# EAGLE design Qwiic EEPROM (EAGLE 9.5.2)
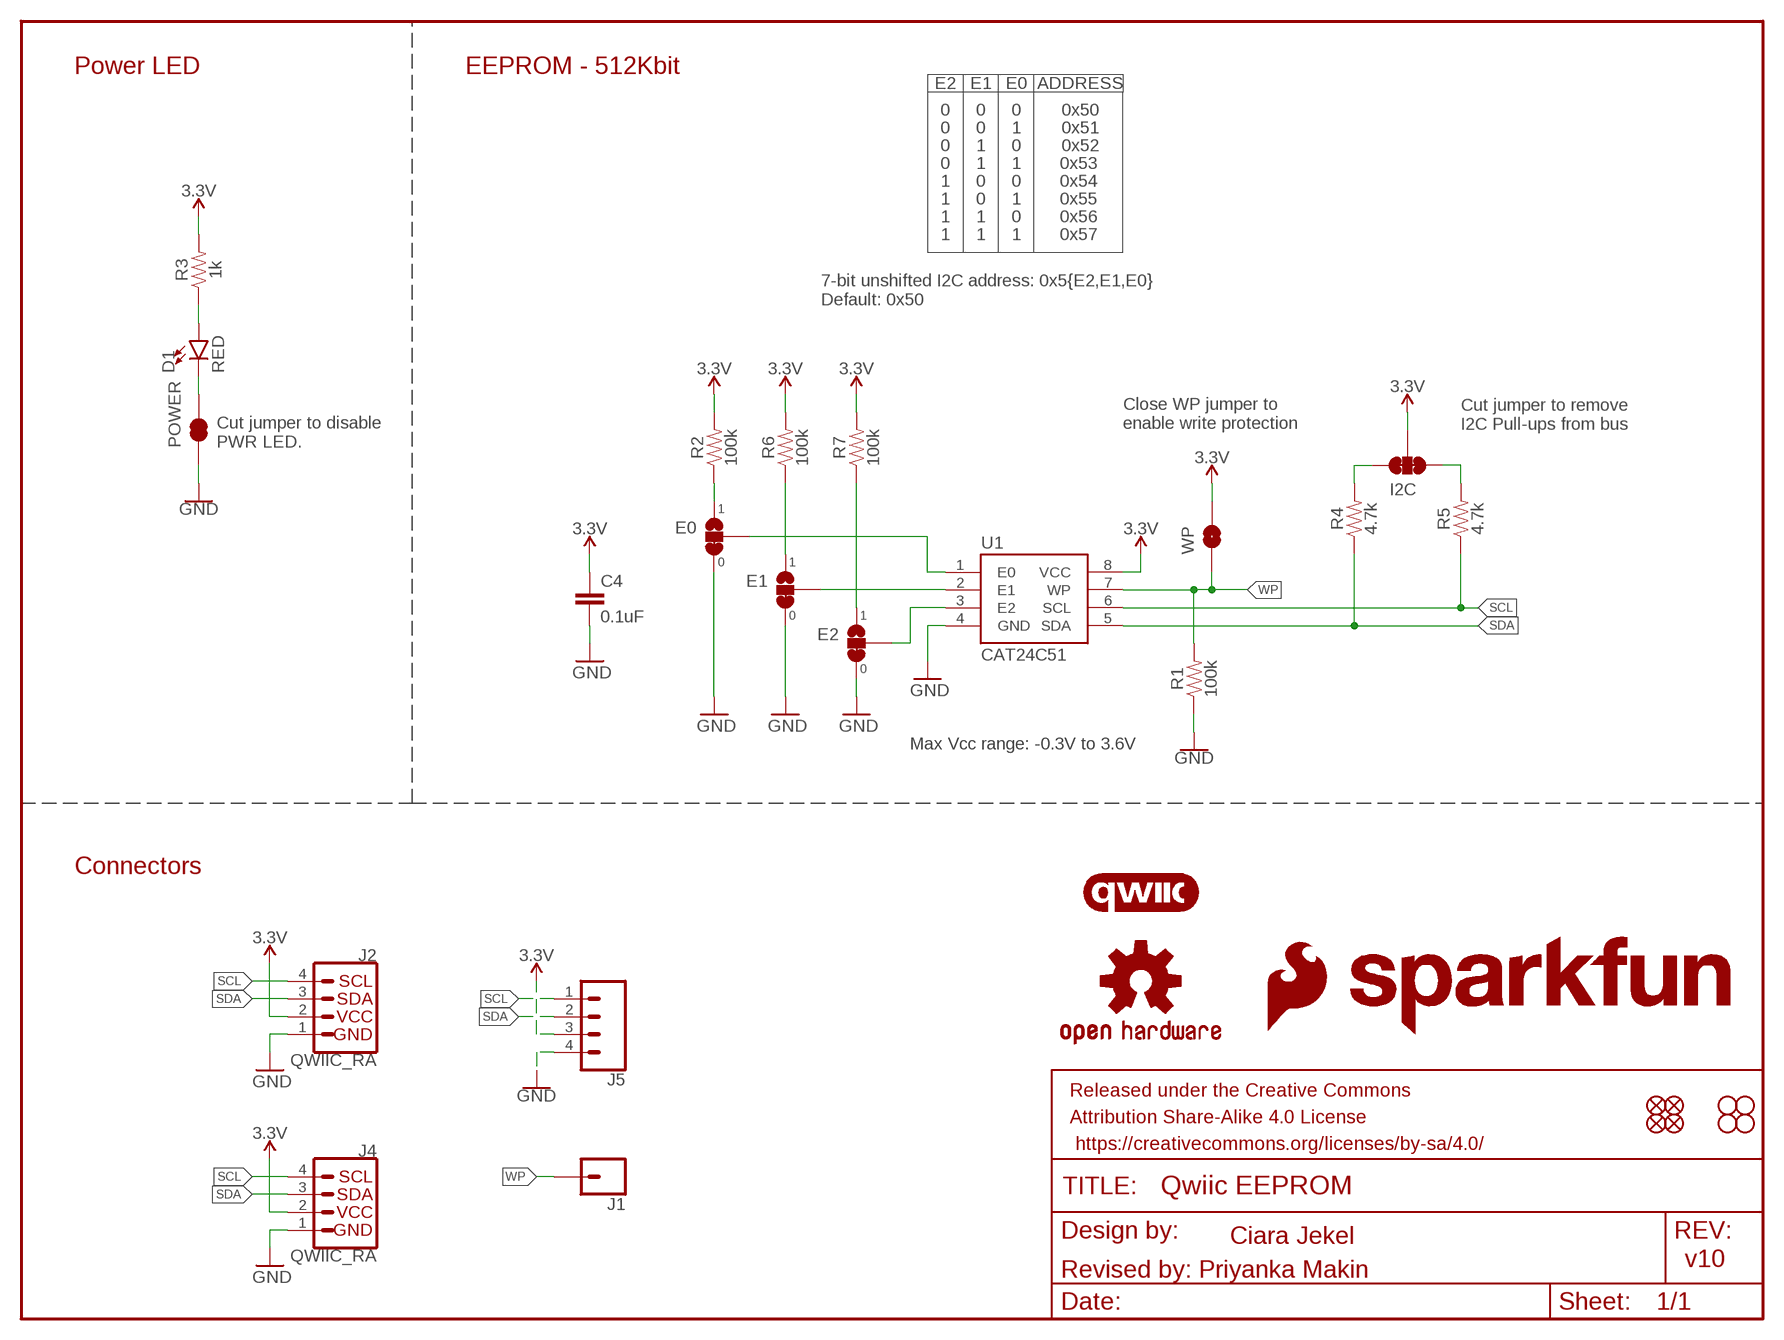
[diagram p0: schematic, sheet 1]

## Parts
C4  0.1uF  0.1UF-0603-25V-(+80/-20%)  [0603]
D1  RED  LED-RED0603  [LED-0603]
E0  JUMPER-SMT_3_1-NC_TRACE_SILK  [SMT-JUMPER_3_1-NC_TRACE_SILK]
E1  JUMPER-SMT_3_1-NC_TRACE_SILK  [SMT-JUMPER_3_1-NC_TRACE_SILK]
E2  JUMPER-SMT_3_1-NC_TRACE_SILK  [SMT-JUMPER_3_1-NC_TRACE_SILK]
FRAME1  FRAME-LETTER  [CREATIVE_COMMONS]
I2C  JUMPER-SMT_3_2-NC_TRACE_SILK  [SMT-JUMPER_3_2-NC_TRACE_SILK]
J1  CONN_01PTH_NO_SILK_YES_STOP  [1X01_NO_SILK]
J2  QWIIC_RA  QWIIC_CONNECTORJS-1MM  [JST04_1MM_RA]
J4  QWIIC_RA  QWIIC_CONNECTORJS-1MM  [JST04_1MM_RA]
J5  CONN_041X04_NO_SILK_NO_POP  [1X04_NO_SILK]
JP1  FIDUCIALUFIDUCIAL  [FIDUCIAL-MICRO]
JP2  FIDUCIALUFIDUCIAL  [FIDUCIAL-MICRO]
JP3  STAND-OFF  [STAND-OFF]
JP4  STAND-OFF  [STAND-OFF]
JP5  FIDUCIALUFIDUCIAL  [FIDUCIAL-MICRO]
JP6  FIDUCIALUFIDUCIAL  [FIDUCIAL-MICRO]
JP7  STAND-OFF  [STAND-OFF]
JP8  STAND-OFF  [STAND-OFF]
LOGO1  OSHW-LOGOMINI  [OSHW-LOGO-MINI]
LOGO2  SFE_LOGO_NAME.1_INCH  [SFE_LOGO_NAME_.1]
LOGO3  SFE_LOGO_FLAME.1_INCH  [SFE_LOGO_FLAME_.1]
LOGO4  QWIIC_LOGO_4MM  [QWIIC_4MM]
POWER  JUMPER-SMT_2_NC_TRACE_SILK  [SMT-JUMPER_2_NC_TRACE_SILK]
R1  100k  100KOHM-0603-1/10W-1%  [0603]
R2  100k  100KOHM-0603-1/10W-1%  [0603]
R3  1k  1KOHM-0603-1/10W-1%  [0603]
R4  4.7k  4.7KOHM-0603-1/10W-1%  [0603]
R5  4.7k  4.7KOHM-0603-1/10W-1%  [0603]
R6  100k  100KOHM-0603-1/10W-1%  [0603]
R7  100k  100KOHM-0603-1/10W-1%  [0603]
U1  CAT24C51  RM24C512C  [SO08]
WP  JUMPER-SMT_2_NO_SILK  [SMT-JUMPER_2_NO_SILK]

## Nets
3.3V: C4.1 I2C.2 J2.2 J4.2 J5.3 R2.2 R3.2 R6.2 R7.2 U1.8(VCC) WP.2
GND: C4.2 E0.3 E1.3 E2.3 J2.1 J4.1 J5.4 POWER.1 R1.1 U1.4(GND)
N$1: I2C.1 R5.2
N$2: I2C.3 R4.2
N$3: D1.A R3.1
N$4: E2.2 U1.3(E2)
N$5: E1.2 U1.2(E1)
N$6: E0.2 U1.1(E0)
N$7: E0.1 R2.1
N$8: E2.1 R7.1
N$9: E1.1 R6.1
N$10: D1.C POWER.2
SCL: J2.4 J4.4 J5.1 R5.1 U1.6(SCL)
SDA: J2.3 J4.3 J5.2 R4.1 U1.5(SDA)
WP: J1.1 R1.2 U1.7(WP) WP.1

## Notes on the sheet
- Power LED | EEPROM - 512Kbit
- E2 | E1 | E0 | ADDRESS
- 0 | 0 | 0 | 0x50
- 0 | 0 | 1 | 0x51
- 0 | 1 | 0 | 0x52
- 0 | 1 | 1 | 0x53
- 1 | 0 | 0 | 0x54
- 1 | 0 | 1 | 0x55
- 1 | 1 | 0 | 0x56
- 1 | 1 | 1 | 0x57
- 7-bit unshifted I2C address: 0x5{E2,E1,E0}
  Default: 0x50
- Cut jumper to remove 
  I2C Pull-ups from bus
- Cut jumper to disable 
  PWR LED.
- Close WP jumper to 
  enable write protection
- 1
- 0 | 1
- 0 | 1
- 0
- Max Vcc range: -0.3V to 3.6V
- Connectors
- Ciara Jekel
- v10
- Revised by: Priyanka Makin

## Library data of the parts
C4 = SparkFun-Capacitors:0.1UF: 0.1µF ceramic capacitors A capacitor is a passive two-terminal electrical component used to store electrical energy temporarily in an electric field.; PROD_ID: CAP-00810
D1 = SparkFun-LED:LED-RED: Red SMD LED Used in manufacturing of most products at SparkFun Packages: 0603 - SMD 0603 package [Product Link] <http://docs.avagotech.com/docs/AV02-0551EN> 0603 SMART - SMD 0603 SMART package ( more efficient and expensive)[Product Link] <http://www.osram-os.com/Graphics/XPic2/00077099_0.pdf> 1206 - SMD1206 package [Product Link] <https://www.sparkfun.com/datasheets/DevTools/LilyPad/Q150OVS4.pdff> SparkFun Products: Pro Mini 328 -5V <https://www.sparkfun.com/products/821> RedBoard <https://www.sparkfun.com/products/12757> IOIO-OTG <https://www.sparkfun.com/products/13613>; PROD_ID: DIO-00819
E0 E1 E2 = SparkFun-Jumpers:JUMPER-SMT_3_1-NC_TRACE: Normally closed trace jumper (1 of 2 connections) This jumper has a trace between two pads so it's normally closed (NC). The other connection is normally open (NO). Use a razor knife to open the connection. For best results follow the IPC guidelines for cutting traces: Cutout at least 0.063 mm (0.005 in). Remove all loose material to clean up the cut area. Seal the cut with an approved epoxy. Reapply solder to reclose the connection, or to close the NO connection.
FRAME1 = SparkFun-Aesthetics:FRAME-LETTER: Schematic Frame - Letter Standard 8.5x11 US Letter frame
I2C = SparkFun-Jumpers:JUMPER-SMT_3_2-NC_TRACE: Normally closed trace jumper (2 of 2 connections) This jumper has a trace between all three pads so they are normally closed (NC). Use a razor knife to open the connection(s). For best results follow the IPC guidelines for cutting traces: Cutout at least 0.063 mm (0.005 in). Remove all loose material to clean up the cut area. Seal the cut with an approved epoxy. Reapply solder to reclose the connection(s).
J1 = SparkFun-Connectors:CONN_01: Single connection point. Often used as Generic Header-pin footprint for 0.1 inch spaced/style header connections On any of the 0.1 inch spaced packages, you can populate with these: Break Away Headers - Straight <https://www.sparkfun.com/products/116> (PRT-00116) Break Away Male Headers - Right Angle <https://www.sparkfun.com/products/553> (PRT-00553) Female Headers <https://www.sparkfun.com/products/115> (PRT-00115) Break Away Headers - Machine Pin <https://www.sparkfun.com/products/117> (PRT-00117) Break Away Female Headers - Swiss Machine Pin <https://www.sparkfun.com/products/743> (PRT-00743) This device is also useful as a general connection point to wire up your design to another part of your project. Our various solder wires solder well into these plated through hole pads. Hook-Up Wire - Assortment (Stranded, 22 AWG) <https://www.sparkfun.com/products/11375> (PRT-11375) Hook-Up Wire - Assortment (Solid Core, 22 AWG) <https://www.sparkfun.com/products/11367> (PRT-11367) View the entire wire category on our website here <https://www.sparkfun.com/categories/141> Special notes: SMTSO-256-ET is a "flush mount" nut for a 4-40 screw. We mostly use this on specialty testbeds; it is a nice way to connect hardware to your PCB at an adjustable hieght. Also note, the SNAP packages are for using a snappable style connector. We sell a baggie of snaps and they are also used on two LilyPad designs: Snap Assortment - 30 pack (male and female) <https://www.sparkfun.com/products/11347> (DEV-11347) LilyPad Arduino SimpleSnap <https://www.sparkfun.com/products/10941> (DEV-10941) LilyPad SimpleSnap Protoboard <https://www.sparkfun.com/products/10940> (DEV-10940)
J2 J4 = SparkFun-Connectors:QWIIC_CONNECTOR: SparkFun I2C Standard Qwiic Connector An SMD 1mm pitch JST connector makes it easy and quick (get it? Qwiic?) to connect I2C devices to each other. The Qwiic system <http://www.sparkfun.com/qwiic> enables fast and solderless connection between popular platforms and various sensors and actuators. We carry 200mm <https://www.sparkfun.com/products/14204>, 100mm <https://www.sparkfun.com/products/14205>, 50mm <https://www.sparkfun.com/products/14206>, and breadboard friendly <https://www.sparkfun.com/products/14207> Qwiic cables. We also offer 10 pcs strips <https://www.sparkfun.com/products/14323> the SMD connectors.; PROD_ID: CONN-13694; VALUE: QWIIC_RIGHT_ANGLE
J5 = SparkFun-Connectors:CONN_04: Multi connection point. Often used as Generic Header-pin footprint for 0.1 inch spaced/style header connections On any of the 0.1 inch spaced packages, you can populate with these: Break Away Headers - Straight <https://www.sparkfun.com/products/116> (PRT-00116) Break Away Male Headers - Right Angle <https://www.sparkfun.com/products/553> (PRT-00553) Female Headers <https://www.sparkfun.com/products/115> (PRT-00115) Break Away Headers - Machine Pin <https://www.sparkfun.com/products/117> (PRT-00117) Break Away Female Headers - Swiss Machine Pin <https://www.sparkfun.com/products/743> (PRT-00743) For SCREWTERMINALS and SPRING TERMINALS visit here: Screw Terimnals on SparkFun.com <https://www.sparkfun.com/search/results?term=Screw+Terminals> (5mm/3.5mm/2.54mm spacing) This device is also useful as a general connection point to wire up your design to another part of your project. Our various solder wires solder well into these plated through hole pads. Hook-Up Wire - Assortment (Stranded, 22 AWG) <https://www.sparkfun.com/products/11375> (PRT-11375) Hook-Up Wire - Assortment (Solid Core, 22 AWG) <https://www.sparkfun.com/products/11367> (PRT-11367) View the entire wire category on our website here <https://www.sparkfun.com/categories/141> Special notes: Molex polarized connector foot print use with SKU : PRT-08231 with associated crimp pins and housings. 1MM SMD Version SKU: PRT-10208
JP1 JP2 JP5 JP6 = SparkFun-Aesthetics:FIDUCIAL: Fiducial Alignment Points Point-of-reference for pick-and-place machines and other optical instruments.
JP3 JP4 JP7 JP8 = SparkFun-Hardware:STAND-OFF: Stand Off Drill holes for mechanically mounting via screws, standoffs, etc. Note: Use the keepout ring to avoid running the screw head into surrounding components. Variant Overviews STAND-OFF - Mechanical footprint for a #4 phillips button head screw. STAND-OFF-TIGHT - Mechanical footprint for a #4 phillips button head screw, Example SparkFun Products Screw - Phillips Head (1/4", 4-40, 10 pack) <https://www.sparkfun.com/products/10453> (PRT-10453) Screw - Phillips Head (1/2", 4-40, 10 pack) <https://www.sparkfun.com/products/10452> (PRT-10452) Screw - Phillips Head (3/4", 4-40, 10 pack) <https://www.sparkfun.com/products/10451> (PRT-10451) Screw - Phillips Head (1", 4-40, 10 pack) <https://www.sparkfun.com/products/10450> (PRT-10450)
LOGO1 = SparkFun-Aesthetics:OSHW-LOGO: Open-Source Hardware (OSHW) Logo This logo indicates the piece of hardware it is found on incorporates a OSHW license and/or adheres to the definition of open source hardware found here: http://freedomdefined.org/OSHW
LOGO2 = SparkFun-Aesthetics:SFE_LOGO_NAME: SparkFun Font Logo This is the SparkFun name logo. The logo on the schematic will always be the same size; the package variant is the height of the flame part of the logo (or the height the flame would be, if it were drawn). Default layer for the logo on the board is tSilk.
LOGO3 = SparkFun-Aesthetics:SFE_LOGO_FLAME: SparkFun Flame Logo This is the SparkFun flame logo. The logo on the schematic will always be the same size; the package variant is the height of the flame. Default layer for the logo on the board is tSilk.
LOGO4 = SparkFun-Aesthetics:QWIIC_LOGO: Qwiic Logos for placement on schematic and PCB. The 5.5mm silk logo is best for placing next to Qwiic connector.
POWER = SparkFun-Jumpers:JUMPER-SMT_2_NC_TRACE: Normally closed trace jumper This jumper has a trace between two pads so it's normally closed (NC). Use a razor knife to open the connection. For best results follow the IPC guidelines for cutting traces: Cutout at least 0.063 mm (0.005 in). Remove all loose material to clean up the cut area. Seal the cut with an approved epoxy. Reapply solder to reclose the connection.
R1 R2 R6 R7 = SparkFun-Resistors:100KOHM: 100kΩ resistor A resistor is a passive two-terminal electrical component that implements electrical resistance as a circuit element. Resistors act to reduce current flow, and, at the same time, act to lower voltage levels within circuits. - Wikipedia; PROD_ID: RES-07828
R3 = SparkFun-Resistors:1KOHM: 1kΩ resistor A resistor is a passive two-terminal electrical component that implements electrical resistance as a circuit element. Resistors act to reduce current flow, and, at the same time, act to lower voltage levels within circuits. - Wikipedia; PROD_ID: RES-07856
R4 R5 = SparkFun-Resistors:4.7KOHM: 4.7kΩ resistor A resistor is a passive two-terminal electrical component that implements electrical resistance as a circuit element. Resistors act to reduce current flow, and, at the same time, act to lower voltage levels within circuits. - Wikipedia; PROD_ID: RES-07857
U1 = SparkFun-IC-Memory:RM24C512C; PROD_ID: IC-14645
WP = SparkFun-Jumpers:JUMPER-SMT_2_NO: Normally open jumper This jumper has two pads in close proximity to each other. Apply solder to close the connection. Round pads are easier to solder for beginners, but are a lot larger. SparkFun Product that uses the round pads: SparkFun EL Sequencer <https://www.sparkfun.com/products/12781>

## Net classes
1 power: width 0.203 mm

## Board
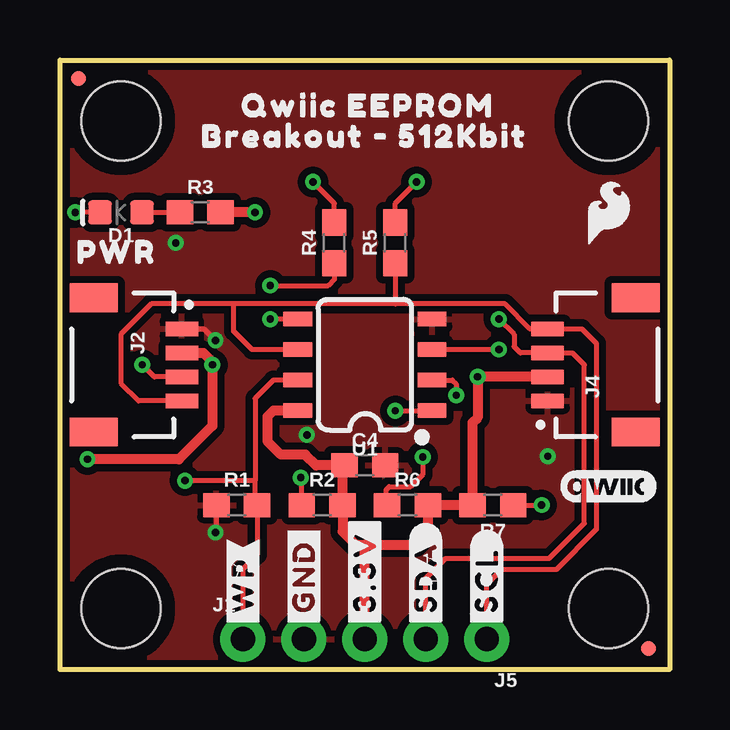
[diagram p1: board, top side]
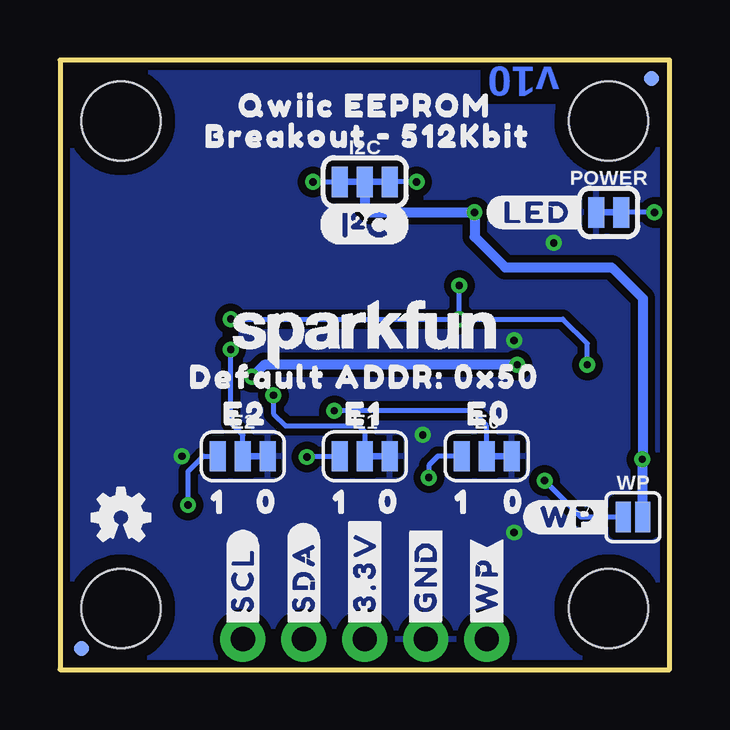
[diagram p2: board, bottom side, seen from below]

Size 25.4 x 25.4 mm. Coordinates in mm from the lower left corner, seen from the top.
Outline: 0,0 0,25.4 25.4,25.4 25.4,0 0,0
Copper layers (1*16): Top 0.035mm / dielectric 1.5mm / Bottom 0.035mm
Design rules "SparkFun-2-Layer-General-JLCPCB": minimum track width 7mil, minimum drill 0.3mm, track to track 7mil, track to pad 7mil, pad to pad 7mil, via to via 7mil, smd to smd 7mil, copper to edge 7mil, drill to drill 7mil, minimum pad ring 7mil, minimum via ring 7mil, stop-mask expansion 3mil, vias tented up to drill 25mil, thermal gap 10mil

### Footprints (pad centres in the part's own frame; a part is rotated, then mirrored left to right if it is on the bottom)
0603 = smd 1.1 x 1: 1 -0.85,0; 2 0.85,0
LED-0603 = smd 1 x 1: A -0.877,0; C 0.877,0
SMT-JUMPER_3_1-NC_TRACE_SILK = smd 0.66 x 1.27: 1 -1.041,0; 2 0,0; 3 1.041,0
SMT-JUMPER_3_2-NC_TRACE_SILK = smd 0.66 x 1.27: 1 -1.041,0; 2 0,0; 3 1.041,0
1X01_NO_SILK = drill 1.016 pad 1.88: 1 0,0
JST04_1MM_RA = smd 0.6 x 1.35: 1 -1.5,0; 2 -0.5,0; 3 0.5,0; 4 1.5,0 | smd 1.2 x 2: NC1 2.8,-3.675; NC2 -2.8,-3.675
1X04_NO_SILK = drill 1.016 pad 1.88: 1 0,0; 2 2.54,0; 3 5.08,0; 4 7.62,0
FIDUCIAL-MICRO = smd 0.635 x 0.635: 1 0,0
STAND-OFF = hole 3.302: 0,0
SMT-JUMPER_2_NC_TRACE_SILK = smd 0.66 x 1.27: 1 -0.521,0; 2 0.521,0
SO08 = smd 0.6 x 1.2: 1 -1.905,-2.8; 2 -0.635,-2.8; 3 0.635,-2.8; 4 1.905,-2.8; 5 1.905,2.8; 6 0.635,2.8; 7 -0.635,2.8; 8 -1.905,2.8
SMT-JUMPER_2_NO_SILK = smd 0.635 x 1.27: 1 -0.406,0; 2 0.406,0

### Placement (x,y rotation side)
C4  12.7,8.51 0 top
D1  2.54,19.05 180 top
E0  7.62,8.89 0 bottom
E1  12.7,8.89 0 bottom
E2  17.78,8.89 0 bottom
FRAME1  -12.7,-12.7 0 top  (outside the outline)
I2C  12.7,20.32 0 bottom
J1  7.62,1.27 0 top
J2  5.08,12.7 270 top
J4  20.32,12.7 90 top
J5  17.78,1.27 180 top
JP1  0.76,24.64 0 bottom
JP2  24.51,0.89 0 top
JP3  2.54,22.86 0 top
JP4  22.86,22.86 0 top
JP5  24.51,0.89 0 bottom
JP6  0.76,24.64 0 top
JP7  2.54,2.54 0 top
JP8  22.86,2.54 0 top
LOGO1  22.86,6.35 0 bottom
LOGO2  12.7,13.97 0 bottom
LOGO3  22.86,19.05 0 top
LOGO4  22.86,7.62 0 top
POWER  2.54,19.05 0 bottom
R1  7.37,6.86 0 top
R2  10.92,6.86 0 top
R3  5.84,19.05 0 top
R4  11.43,17.78 90 top
R5  13.97,17.78 90 top
R6  14.48,6.86 0 top
R7  18.03,6.86 180 top
U1  12.7,12.7 90 top
U$1  [#WP#3]  7.62,1.65 90 top
U$2  [#WP#3]  7.62,1.65 90 bottom
U$3  [#WP#0]  6.1,6.35 0 bottom
U$4  [E00]  9.14,10.67 0 bottom
U$5  [E10]  14.22,10.67 0 bottom
U$6  [E20]  19.3,10.67 0 bottom
U$7  [00]  7.62,6.99 0 bottom
U$8  [00]  12.83,6.99 0 bottom
U$9  [00]  17.91,6.99 0 bottom
U$10  [#GND#0]  10.16,1.65 90 top
U$11  [(I_SUPER2_C)]  14.61,18.54 0 bottom
U$12  [PWR0]  0,17.4 0 top
U$13  [10]  19.81,6.99 0 bottom
U$14  [#GND#0]  10.16,1.65 90 bottom
U$15  [#3#3V#0]  12.7,1.65 90 top
U$16  [#3#3V#0]  12.7,1.65 90 bottom
U$17  [#SDA#0]  15.24,1.65 90 top
U$18  [#LED#2]  7.62,19.05 0 bottom
U$19  [QWIIC_EEPROM0]  6.86,23.5 0 top
U$20  [QWIIC_EEPROM0]  18.67,23.5 0 bottom
U$21  [10]  14.73,6.99 0 bottom
U$22  [10]  9.65,6.99 0 bottom
U$23  [BREAKOUT_#_512KBIT0]  5.21,22.23 0 top
U$24  [BREAKOUT_#_512KBIT0]  20.07,22.23 0 bottom
U$25  [DEFAULT_ADDR#_0X500]  20.7,12.19 0 bottom
U$29  [#SDA#0]  15.24,1.65 90 bottom
U$30  [#SCL#0]  17.78,1.65 90 top
U$31  [#SCL#0]  17.78,1.65 90 bottom
WP  1.52,6.35 0 bottom

### Tracks (layer width: path | path; a pad name or v marks a point on that pad's centre or on a via)
3.3V  (via drill 0.3)
  Top 0.203: 6.35,12.83 v6.35,12.7 | 11.77,8.43 C4.1
  Top 0.406: J2.2 5.98,13.2 6.35,12.83 | v6.35,12.7 6.35,10.16 4.95,8.76 v1.14,8.76 | C4.1 10.67,8.51 10.22,8.95 9.21,8.95 8.64,9.53 8.64,10.54 8.89,10.79 U1.8 | 12.7,5.21 12.32,5.21 11.77,5.75 R2.2 11.77,8.43 | 12.7,5.21 14.82,5.21 15.33,5.71 R6.2 R7.2 17.18,10.29 17.4,10.5 v17.4,12.2 J4.2 | J5.3 12.7,5.21 | v8.13,19.05 R3.2
  Bottom 0.203: v1.14,8.76 1.12,8.76
  Bottom 0.406: WP.2 1.12,8.76 1.12,15.47 2.41,16.76 6.86,16.76 8.13,18.03 v8.13,19.05 12.45,19.05 12.7,19.3 I2C.2 | v6.35,12.7 16.9,12.7 v17.4,12.2
GND  (via drill 0.3)
  Top 0.203: J2.1 5.99,14.2 v6.48,13.72 | R1.1 6.52,5.75 v6.48,5.71
  other vias: 20.32,8.89 4.83,17.78 10.29,9.78
  pour Bottom (isolate 0.305): 0,0 0,25.4 25.4,25.4 25.4,0
  pour Top (isolate 0.305): 0,0 0,25.4 25.4,25.4 25.4,0
N$1  (via drill 0.3)
  Top 0.203: R5.2 13.97,19.43 v14.86,20.32
  Bottom 0.203: v14.86,20.32 I2C.1
N$2  (via drill 0.3)
  Top 0.203: R4.2 11.43,19.43 v10.54,20.32
  Bottom 0.203: v10.54,20.32 I2C.3
N$3
  Top 0.203: D1.A R3.1
N$4  (via drill 0.3)
  Top 0.203: v18.29,13.34 U1.3
  Bottom 0.203: E2.2 17.78,9.78 18.29,10.29 v18.29,13.34
N$5  (via drill 0.3)
  Top 0.203: U1.2 16.35,12.06 16.51,11.9 v16.51,11.43
  Bottom 0.203: v16.51,11.43 16.51,10.67 16,10.16 12.95,10.16 12.7,9.91 E1.2
N$6  (via drill 0.3)
  Top 0.203: v13.97,10.78 15.49,10.78 U1.1
  Bottom 0.203: E0.2 7.62,10.16 8.26,10.79 13.96,10.79 v13.97,10.78
N$7  (via drill 0.3)
  Top 0.203: R2.1 10.07,7.96 v10.03,8
  Bottom 0.203: E0.1 9.65,8.89 10.03,8.51 v10.03,8
N$8  (via drill 0.3)
  Top 0.203: R7.1 v20.07,6.86
  Bottom 0.203: v20.07,6.86 20.07,8.26 19.43,8.89 E2.1
N$9  (via drill 0.3)
  Top 0.203: R6.1 13.59,6.9 13.59,7.49 13.72,7.62 14.61,7.62 15.11,8.13 v15.11,8.86
  Bottom 0.203: E1.1 15.08,8.89 v15.11,8.86
N$10  (via drill 0.3)
  Top 0.203: D1.C v0.64,19.05
  Bottom 0.203: v0.64,19.05 POWER.2
SCL
  Top 0.203: 13.97,15.24 18.54,15.24 19.58,14.2 J4.4 21.74,14.2 22.35,13.59 22.35,5.84 20.7,4.19 18.41,4.19 17.78,3.56 J5.1 | 13.97,15.24 7.24,15.24 | 7.24,15.24 3.81,15.24 2.54,13.97 2.54,11.94 3.28,11.2 J2.4 | U1.6 8,13.34 7.24,14.1 7.24,15.24 | R5.1 13.97,15.24
SDA  (via drill 0.3)
  Top 0.203: v18.29,14.61 18.92,13.97 18.92,13.46 19.18,13.2 J4.3 21.34,13.2 21.84,12.7 21.84,6.1 20.38,4.64 16.07,4.64 15.24,3.81 J5.2 | J2.3 3.93,12.2 v3.43,12.7 | U1.5 v8.76,14.61 | R4.1 11.43,16.26 11.18,16 v8.76,16
  Bottom 0.203: v3.43,12.7 3.43,13.59 4.45,14.61 v8.76,14.61 | v18.29,14.61 v8.76,14.61 | v8.76,14.61 v8.76,16
WP  (via drill 0.3)
  Top 0.203: U1.7 8.89,12.06 8.13,11.3 8.13,7.87 | J1.1 7.62,4.19 8.22,4.79 R1.2 8.13,6.95 8.13,7.87 | 8.13,7.87 v5.21,7.87
  Bottom 0.203: WP.1 3.68,6.35 v5.21,7.87

### Text on the board
Bottom: v10
Measures: Dimensions in Inches
tDocu: Ciara Jekel | Revised by: Priyanka Makin